# Altium schematic sheet LPF_Block.SchDoc
size A4; SheetNumber: 12; SheetTotal: 13
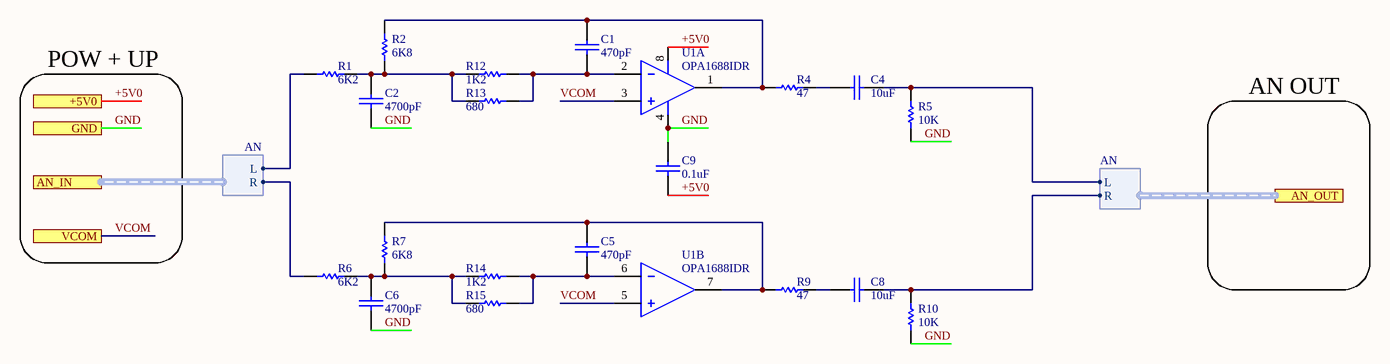
[diagram p0: LPF_Block.SchDoc]

## Parts
C1  470pF  [0402-CAP-TDK]
C2  4700pF  [0402-CAP-TDK]
C4  10uF  [0603-CAP-TDK]
C5  470pF  [0402-CAP-TDK]
C6  4700pF  [0402-CAP-TDK]
C8  10uF  [0603-CAP-TDK]
C9  0.1uF  [0402-CAP-TDK]
R1  6K2  [0603-RES-PANASONIC]
R2  6K8  [0402-RES-PANASONIC]
R4  47  [0402-RES-PANASONIC]
R5  10K  [0402-RES-PANASONIC]
R6  6K2  [0603-RES-PANASONIC]
R7  6K8  [0402-RES-PANASONIC]
R9  47  [0402-RES-PANASONIC]
R10  10K  [0402-RES-PANASONIC]
R12  1K2  [0402-RES-PANASONIC]
R13  680  [0402-RES-PANASONIC]
R14  1K2  [0402-RES-PANASONIC]
R15  680  [0402-RES-PANASONIC]
U1  OPA1688IDR  [TI-SOIC-8]  (parts A,B of 2)

## Ports
+5V0 (see LPF_Interface[2B], DAC_Block[1B], LPF_Interface[1B], POW_Block[4B]), AN_IN (harness AN, see LPF_Interface[2B]), AN_OUT (harness AN, see LPF_Interface[3B]), GND (see LPF_Interface[2B], ADC_Block[1B], ADC_Interface[1B], CTRL_Connectors[1A], DAC_Block[1B], DSP_Block[1A], IN_Connectors[3A], LPF_Interface[1B], MCU_Block[1B], OUT_Connectors[3B], PLL_Block[1A], POW_Block[1B]), VCOM (see LPF_Interface[2B], DAC_Block[4C], LPF_Interface[1B])

## Harnesses
AN: L, R

## Nets
+5V0: C9.1 U1.8(VDD) ; port +5V0
GND: C2.1 C6.1 C9.2 R5.1 R10.1 U1.4(GND) ; port GND
VCOM: U1.3(1IN+) U1.5(2IN+) ; port VCOM
NetC1_1: C1.1 R12.2 R13.2 U1.2(1IN-)
NetC1_2: C1.2 R2.2 R4.2 U1.1(1OUT)
NetC2_2: C2.2 R1.1 R2.1 R12.1 R13.1
NetC4_1: C4.1 R5.2 ; port AN_OUT.L
NetC4_2: C4.2 R4.1
NetC5_1: C5.1 R14.2 R15.2 U1.6(2IN-)
NetC5_2: C5.2 R7.2 R9.2 U1.7(2OUT)
NetC6_2: C6.2 R6.1 R7.1 R14.1 R15.1
NetC8_1: C8.1 R10.2 ; port AN_OUT.R
NetC8_2: C8.2 R9.1
NetR1_2: R1.2 ; port AN_IN.L
NetR6_2: R6.2 ; port AN_IN.R

## Notes on the sheet
- POW + UP
- AN OUT

## Library data of the parts
C1 C2 C4-C6 C8 C9 = CAP-SMD
  C1 C5: JLCPart: C1537
  C2 C6: JLCPart: C1538
  C4 C8: JLCPart: C96446
  C9: JLCPart: C307331
R1 R2 R4-R7 R9 R10 R12-R15 = RES-SMD
  R1 R6: JLCPart: C4260
  R2 R7: JLCPart: C25917
  R4 R9: JLCPart: C25118
  R5 R10: JLCPart: C25744
  R12 R14: JLCPart: C25862
  R13 R15: JLCPart: C25130
U1 = OPA1688IDR: Rail-To-Rail Amplifier 2 Circuit - 8-SOIC; JLCPart: C206212